# EAGLE design MY9942_CON_4 (EAGLE 9.6.2)
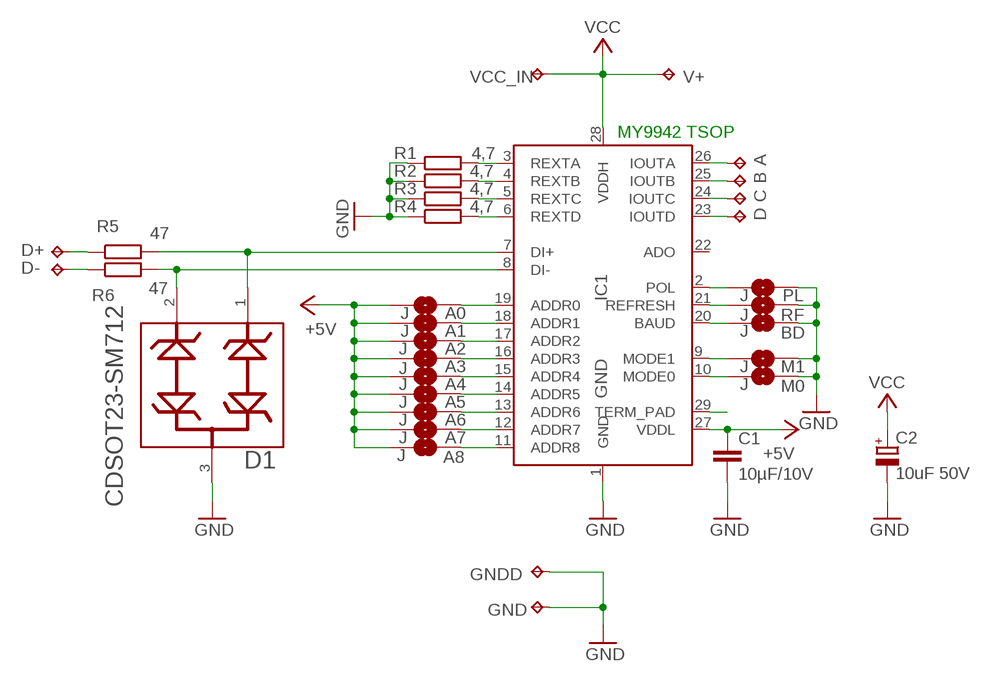
[diagram p0: schematic, sheet 1]

## Parts
A  TPPAD1-13  [P1-13]
A0  J  JUMPER-SMT_2_NO_SILK  [SMT-JUMPER_2_NO_SILK]
A1  J  JUMPER-SMT_2_NO_SILK  [SMT-JUMPER_2_NO_SILK]
A2  J  JUMPER-SMT_2_NO_SILK  [SMT-JUMPER_2_NO_SILK]
A3  J  JUMPER-SMT_2_NO_SILK  [SMT-JUMPER_2_NO_SILK]
A4  J  JUMPER-SMT_2_NO_SILK  [SMT-JUMPER_2_NO_SILK]
A5  J  JUMPER-SMT_2_NO_SILK  [SMT-JUMPER_2_NO_SILK]
A6  J  JUMPER-SMT_2_NO_SILK  [SMT-JUMPER_2_NO_SILK]
A7  J  JUMPER-SMT_2_NO_SILK  [SMT-JUMPER_2_NO_SILK]
A8  J  JUMPER-SMT_2_NO_SILK  [SMT-JUMPER_2_NO_SILK]
B  TPPAD1-13  [P1-13]
BD  J  JUMPER-SMT_2_NO_SILK  [SMT-JUMPER_2_NO_SILK]
C  TPPAD1-13  [P1-13]
C1  10µF/10V  C-EUC0805  [C0805]
C2  10uF 50V  CPOL-EUSMCC  [SMC_C]
D  TPPAD1-13  [P1-13]
D1  SM712 / SOT23-3  BOURNS_INC._CDSOT23-SM712BOURNS_INC._CDSOT23-SM712_0_0  [BOURNS_INC._CDSOT23-SM712_0]
D+  TPPAD1-13  [P1-13]
D-  TPPAD1-13  [P1-13]
GND  TPPAD1-13  [P1-13]
GNDD  TPPAD1-13  [P1-13]
IC1  GND  MY9942TETSSOP28  [TSSOP28]
M0  J  JUMPER-SMT_2_NO_SILK  [SMT-JUMPER_2_NO_SILK]
M1  J  JUMPER-SMT_2_NO_SILK  [SMT-JUMPER_2_NO_SILK]
PL  J  JUMPER-SMT_2_NO_SILK  [SMT-JUMPER_2_NO_SILK]
R1  4,7  R-EU_R0805  [R0805]
R2  4,7  R-EU_R0805  [R0805]
R3  4,7  R-EU_R0805  [R0805]
R4  4,7  R-EU_R0805  [R0805]
R5  47  R-EU_R0805  [R0805]
R6  47  R-EU_R0805  [R0805]
RF  J  JUMPER-SMT_2_NO_SILK  [SMT-JUMPER_2_NO_SILK]
V+  TPPAD1-13  [P1-13]
VCC_IN  TPPAD1-13  [P1-13]

## Nets
+5V: A0.1 A1.1 A2.1 A3.1 A4.1 A5.1 A6.1 A7.1 A8.1 C1.1 IC1.27(VDDL)
A: A.TP IC1.26(IOUTA)
B: B.TP IC1.25(IOUTB)
C: C.TP IC1.24(IOUTC)
D: D.TP IC1.23(IOUTD)
D+: D1.1 IC1.7(DI+) R5.2
D-: D1.2 IC1.8(DI-) R6.2
GND: BD.2 C1.2 C2.- D1.3 GND.TP GNDD.TP IC1.1(GND) M0.2 M1.2 PL.2 R1.1 R2.1 R3.1 R4.1 RF.2
N$1: A8.2 IC1.11(ADDR8)
N$2: A7.2 IC1.12(ADDR7)
N$3: A6.2 IC1.13(ADDR6)
N$4: A5.2 IC1.14(ADDR5)
N$5: A4.2 IC1.15(ADDR4)
N$6: A3.2 IC1.16(ADDR3)
N$7: A2.2 IC1.17(ADDR2)
N$8: A1.2 IC1.18(ADDR1)
N$9: A0.2 IC1.19(ADDR0)
N$10: D+.TP R5.1
N$11: IC1.3(REXTA) R1.2
N$12: IC1.4(REXTB) R2.2
N$13: IC1.5(REXTC) R3.2
N$14: IC1.6(REXTD) R4.2
N$15: D-.TP R6.1
N$16: BD.1 IC1.20(BAUD)
N$17: IC1.9(MODE1) M1.1
N$18: IC1.10(MODE0) M0.1
N$31: IC1.21(REFRESH) RF.1
N$32: IC1.2(POL) PL.1
TERM: IC1.29(TERM_PAD)
VCC: C2.+ IC1.28(VDDH) V+.TP VCC_IN.TP
Unconnected: IC1.22(ADO)

## Notes on the sheet
- MY9942 TSOP

## Library data of the parts
A B C D D+ D- GND GNDD V+ VCC_IN = testpad:TP: Test pad
A0 A1-A8 BD M0 M1 PL RF = SparkFun-Jumpers:JUMPER-SMT_2_NO: Normally open jumper This jumper has two pads in close proximity to each other. Apply solder to close the connection. Round pads are easier to solder for beginners, but are a lot larger. SparkFun Product that uses the round pads: SparkFun EL Sequencer <https://www.sparkfun.com/products/12781>
C1 = rcl:C-EU: CAPACITOR, European symbol; SPICEPREFIX: C
C2 = rcl:CPOL-EU: POLARIZED CAPACITOR, European symbol; SPICEPREFIX: C
D1 = Bourns Inc. - CDSOT23-SM712:BOURNS_INC._CDSOT23-SM712: 26V, 14V Clamp 17A (8/20µs) Ipp Tvs Diode Surface Mount SOT-23-3; AUTOMOTIVE: No; BREAKDOWN_VOLTAGE: 7.5V; CAPACITANCE: 75pF; CENTROID_NOT_SPECIFIED: No; CLAMPING_VOLTAGE: 26V; DATASHEET: https://www.bourns.com/docs/Product-Datasheets/CDSOT23-SM712.pdf; DEVICE_CLASS_L1: Circuit Protection; DEVICE_CLASS_L2: TVS Diodes; DEVICE_CLASS_L3: unset; DIGIKEY_DESCRIPTION: DIODE TVS DIODE 7V/12V 14V/26V SOT23-3; DIGIKEY_PART_NUMBER: CDSOT23-SM712CT-ND; DIRECTION: Bidirectional; FOOTPRINT_PARAMETERS_1: {"fp_type":"SOT23","params":{"N":{"default":"3","long name":"Number of leads","type":"multichoice","short name":"N"},"A":{"nom":false,"long name":"Height","min":890000,"max":1170000,"short name":"A","type":"measurement"},"A1":{"nom":false,"long name":"Package clearance","min":50000,"max":150000,"short name":"A1","type":"measurement"},"A2":{"nom":false,"long name":"Package height","min":false,"max":1120000,"short name":"A2","type":"measurement"},"D":{"nom":false,"long name":"Package length","min":2800000,"max":3000000,"short name":"D","type":"measurement"},"E":{"nom":false,"long name":"Width /w leads","min":2100000,"max":2490000,"short name":"E","type":"measurement"},"E1":{"nom":false,"long name":"Package width","min":1200000,"max":1400000,"short name":"E1","type":"measurement"},"B":{"nom":false,"long name":"Lead width","min":300000,"max":500000,"short name":"B","type":"measurement"},"C":{"nom":false,"long name":"Lead thickness","min":80000,"max":200000,"short name":"C","type":"measurement"},"L":{"nom":false,"long name":"Lead foot length","min":400000,"max":580000,"short name":"L","type":"measurement"},"e":{"nom":950000,"long name":"Lead pitch","min":null,"max":null,"short name":"e","type":"measurement"},"PHI":{"nom":false,"long name":"Lead angle","min":0,"max":8,"short name":"PHI","type":"measurement"},"offset x":{"nom":0,"long name":"X Center offset","min":null,"max":null,"short name":"offset x","type":"measurement"},"offset y":{"nom":0,"long name":"Y Center offset","min":null,"max":null,"short name":"offset y","type":"measurement"},"LS":{"default":"Rounded rectangle","long name":"Land shape","type":"multichoice","short name":"LS"},"LS1":{"default":"Rectangle","long name":"Land shape (Pin 1)","type":"multichoice","short name":"LS1"},"solder toe":{"nom":550000,"long name":"Solder fillet (toe)","min":null,"max":null,"short name":"solder toe","type":"fixedmeasurement"},"solder heel":{"nom":450000,"long name":"Solder fillet (heel)","min":null,"max":null,"short name":"solder heel","type":"fixedmeasurement"},"solder side":{"nom":50000,"long name":"Solder fillet (side)","min":null,"max":null,"short name":"solder side","type":"fixedmeasurement"},"courtyard":{"nom":500000,"long name":"Courtyard","min":null,"max":null,"short name":"courtyard","type":"fixedmeasurement"},"SF":{"default":"A","long name":"Packing level","type":"multichoiceparent","short name":"SF","help":"http://support.upverter.com/customer/portal/articles/978783-what-is-a-footprint-packing-level","children":["solder toe","solder heel","solder side","courtyard"]}}}; FOOTPRINT_PARAMETERS_2: {"fp_type":"SOT23","params":{"N":{"default":"3","long name":"Number of leads","type":"multichoice","short name":"N"},"A":{"nom":false,"long name":"Height","min":890000,"max":1170000,"short name":"A","type":"measurement"},"A1":{"nom":false,"long name":"Package clearance","min":50000,"max":150000,"short name":"A1","type":"measurement"},"A2":{"nom":false,"long name":"Package height","min":false,"max":1120000,"short name":"A2","type":"measurement"},"D":{"nom":false,"long name":"Package length","min":2800000,"max":3000000,"short name":"D","type":"measurement"},"E":{"nom":false,"long name":"Width /w leads","min":2100000,"max":2490000,"short name":"E","type":"measurement"},"E1":{"nom":false,"long name":"Package width","min":1200000,"max":1400000,"short name":"E1","type":"measurement"},"B":{"nom":false,"long name":"Lead width","min":300000,"max":500000,"short name":"B","type":"measurement"},"C":{"nom":false,"long name":"Lead thickness","min":80000,"max":200000,"short name":"C","type":"measurement"},"L":{"nom":false,"long name":"Lead foot length","min":400000,"max":580000,"short name":"L","type":"measurement"},"e":{"nom":950000,"long name":"Lead pitch","min":null,"max":null,"short name":"e","type":"measurement"},"PHI":{"nom":false,"long name":"Lead angle","min":0,"max":8,"short name":"PHI","type":"measurement"},"offset x":{"nom":0,"long name":"X Center offset","min":null,"max":null,"short name":"offset x","type":"measurement"},"offset y":{"nom":0,"long name":"Y Center offset","min":null,"max":null,"short name":"offset y","type":"measurement"},"LS":{"default":"Rounded rectangle","long name":"Land shape","type":"multichoice","short name":"LS"},"LS1":{"default":"Rectangle","long name":"Land shape (Pin 1)","type":"multichoice","short name":"LS1"},"solder toe":{"nom":350000,"long name":"Solder fillet (toe)","min":null,"max":null,"short name":"solder toe","type":"fixedmeasurement"},"solder heel":{"nom":350000,"long name":"Solder fillet (heel)","min":null,"max":null,"short name":"solder heel","type":"fixedmeasurement"},"solder side":{"nom":30000,"long name":"Solder fillet (side)","min":null,"max":null,"short name":"solder side","type":"fixedmeasurement"},"courtyard":{"nom":250000,"long name":"Courtyard","min":null,"max":null,"short name":"courtyard","type":"fixedmeasurement"},"SF":{"default":"B","long name":"Packing level","type":"multichoiceparent","short name":"SF","help":"http://support.upverter.com/customer/portal/articles/978783-what-is-a-footprint-packing-level","children":["solder toe","solder heel","solder side","courtyard"]}}}; FOOTPRINT_PARAMETERS_3: {"fp_type":"SOT23","params":{"N":{"default":"3","long name":"Number of leads","type":"multichoice","short name":"N"},"A":{"nom":false,"long name":"Height","min":890000,"max":1170000,"short name":"A","type":"measurement"},"A1":{"nom":false,"long name":"Package clearance","min":50000,"max":150000,"short name":"A1","type":"measurement"},"A2":{"nom":false,"long name":"Package height","min":false,"max":1120000,"short name":"A2","type":"measurement"},"D":{"nom":false,"long name":"Package length","min":2800000,"max":3000000,"short name":"D","type":"measurement"},"E":{"nom":false,"long name":"Width /w leads","min":2100000,"max":2490000,"short name":"E","type":"measurement"},"E1":{"nom":false,"long name":"Package width","min":1200000,"max":1400000,"short name":"E1","type":"measurement"},"B":{"nom":false,"long name":"Lead width","min":300000,"max":500000,"short name":"B","type":"measurement"},"C":{"nom":false,"long name":"Lead thickness","min":80000,"max":200000,"short name":"C","type":"measurement"},"L":{"nom":false,"long name":"Lead foot length","min":400000,"max":580000,"short name":"L","type":"measurement"},"e":{"nom":950000,"long name":"Lead pitch","min":null,"max":null,"short name":"e","type":"measurement"},"PHI":{"nom":false,"long name":"Lead angle","min":0,"max":8,"short name":"PHI","type":"measurement"},"offset x":{"nom":0,"long name":"X Center offset","min":null,"max":null,"short name":"offset x","type":"measurement"},"offset y":{"nom":0,"long name":"Y Center offset","min":null,"max":null,"short name":"offset y","type":"measurement"},"LS":{"default":"Rounded rectangle","long name":"Land shape","type":"multichoice","short name":"LS"},"LS1":{"default":"Rectangle","long name":"Land shape (Pin 1)","type":"multichoice","short name":"LS1"},"solder toe":{"nom":150000,"long name":"Solder fillet (toe)","min":null,"max":null,"short name":"solder toe","type":"fixedmeasurement"},"solder heel":{"nom":250000,"long name":"Solder fillet (heel)","min":null,"max":null,"short name":"solder heel","type":"fixedmeasurement"},"solder side":{"nom":10000,"long name":"Solder fillet (side)","min":null,"max":null,"short name":"solder side","type":"fixedmeasurement"},"courtyard":{"nom":100000,"long name":"Courtyard","min":null,"max":null,"short name":"courtyard","type":"fixedmeasurement"},"SF":{"default":"C","long name":"Packing level","type":"multichoiceparent","short name":"SF","help":"http://support.upverter.com/customer/portal/articles/978783-what-is-a-footprint-packing-level","children":["solder toe","solder heel","solder side","courtyard"]}}}; FOOTPRINT_VARIANT_NAME_0: Recommended_Land_Pattern; FOOTPRINT_VARIANT_NAME_1: IPC_A; FOOTPRINT_VARIANT_NAME_2: IPC_B; FOOTPRINT_VARIANT_NAME_3: IPC_C; HEIGHT: 1.17mm; IPC_LAND_PATTERN_NAME: SOT95P229X103-3; LEAD_FREE: Yes; MF: Bourns Inc.; MFG_PACKAGE_IDENT: SOT23; MFG_PACKAGE_IDENT_DATE: 0; MFG_PACKAGE_IDENT_REV: 0; MOUSER_DESCRIPTION: Transient Voltage Suppressor, TVS, CDSOT23 Series, Unidirectional, 12 V, SOT-23, 3, 13.3 V; MOUSER_PART_NUMBER: 652-CDSOT23-SM712; MPN: CDSOT23-SM712; NUMBER_OF_CHANNELS: 2; PACKAGE: SOT23-3; PEAK_PULSE_CURRENT: 17A; PEAK_PULSE_POWER: 400W; PREFIX: D; REVERSE_STANDOFF_VOLTAGE: 12V; ROHS: Yes; STANDOFF_HEIGHT: 0.05mm; TEMPERATURE_RANGE_HIGH: +150°C; TEMPERATURE_RANGE_LOW: -55°C; VERIFICATION_VERSION: 0.0.0.3
IC1 = MY9942:MY9942TE
R1-R4 = resistor:R-EU_: RESISTOR, European symbol
R5 R6 = rcl:R-EU_: RESISTOR, European symbol; SPICEPREFIX: R

## Board
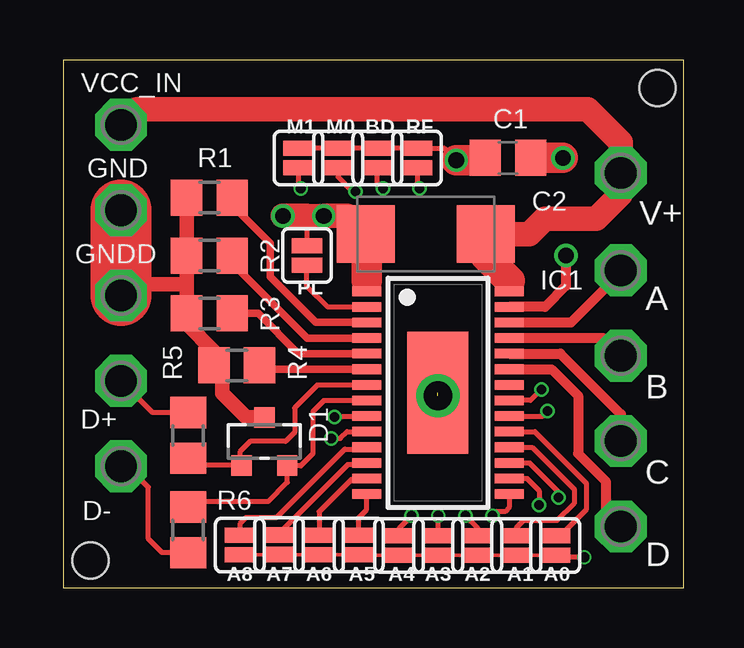
[diagram p1: board, top side]
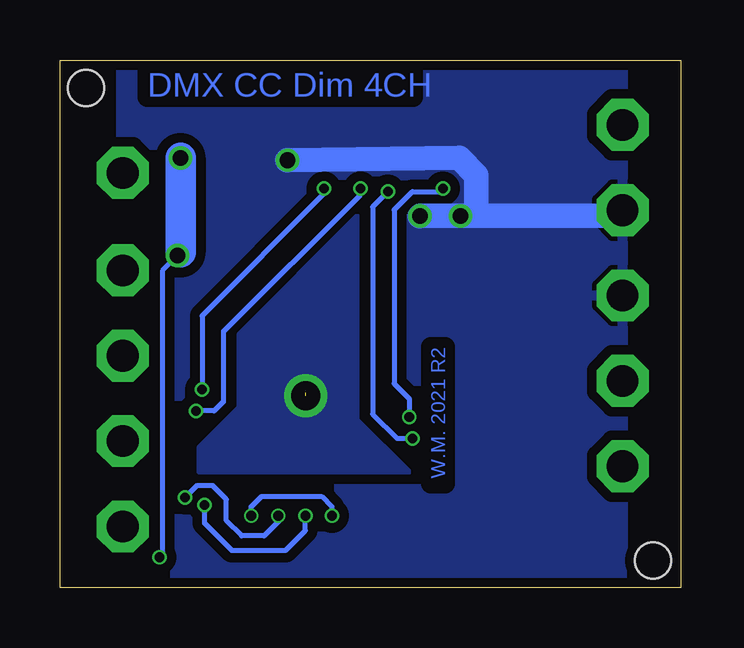
[diagram p2: board, bottom side, seen from below]

Size 25.86 x 21.99 mm. Coordinates in mm from the lower left corner, seen from the top.
Outline: 0,0 25.86,0 25.86,21.99 0,21.99 0,0
Copper layers (1*16): Top 0.018mm / dielectric 1.55mm / Bottom 0.018mm
Design rules "Multi-CB_2L_100µm-Tracks_OL35µm": minimum track width 0.1mm, minimum drill 0.2mm, track to track 0.1mm, track to pad 0.1mm, pad to pad 0.1mm, via to via 0.1mm, smd to smd 0mil, copper to edge 0.2mm, drill to drill 0.2mm, minimum pad ring 0.125mm, minimum via ring 0.1mm, stop-mask expansion 2mil, vias tented up to drill 0.45mm, thermal gap 0.2mm
Holes 1.5 mm at 24.77,20.83 1.14,1.14

### Footprints (pad centres in the part's own frame; a part is rotated, then mirrored left to right if it is on the bottom)
P1-13 = drill 1.321 pad 2.159 octagon: TP 0,0
SMT-JUMPER_2_NO_SILK = smd 0.635 x 1.27: 1 -0.406,0; 2 0.406,0
C0805 = smd 1.3 x 1.5: 1 -0.95,0; 2 0.95,0
SMC_C = smd 2.4 x 2.4: + -2.5,0; - 2.5,0
BOURNS_INC._CDSOT23-SM712_0 = smd 0.85 x 0.85: 1 -1,0.95; 2 -1,-0.95; 3 1,0
TSSOP28 = smd 0.4 x 1.2: 1 -4.225,-2.97; 2 -3.575,-2.97; 3 -2.925,-2.97; 4 -2.275,-2.97; 5 -1.625,-2.97; 6 -0.975,-2.97; 7 -0.325,-2.97; 8 0.325,-2.97; 9 0.975,-2.97; 10 1.625,-2.97; 11 2.275,-2.97; 12 2.925,-2.97; 13 3.575,-2.97; 14 4.225,-2.97; 15 4.225,2.97; 16 3.575,2.97; 17 2.925,2.97; 18 2.275,2.97; 19 1.625,2.97; 20 0.975,2.97; 21 0.325,2.97; 22 -0.325,2.97; 23 -0.975,2.97; 24 -1.625,2.97; 25 -2.275,2.97; 26 -2.925,2.97; 27 -3.575,2.97; 28 -4.225,2.97 | smd 5.08 x 2.54: 29 0,0
R0805 = smd 1.3 x 1.5: 1 -0.95,0; 2 0.95,0

### Placement (x,y rotation side)
A  23.24,13.22 0 top
A0  20.51,1.76 90 top
A1  18.89,1.76 90 top
A2  17.25,1.76 90 top
A3  15.63,1.76 90 top
A4  14,1.76 90 top
A5  12.32,1.78 90 top
A6  10.67,1.78 90 top
A7  9,1.79 90 top
A8  7.37,1.78 90 top
B  23.24,9.67 0 top
BD  13.1,17.91 90 top
C  23.24,6.11 0 top
C1  18.54,17.91 180 top
C2  15.11,14.73 180 top
D  23.24,2.56 0 top
D1  8.39,6.1 90 top
D+  2.41,8.62 0 top
D-  2.41,5.06 0 top
GND  2.41,15.73 0 top
GNDD  2.41,12.18 0 top
IC1  15.62,8.13 270 top
M0  11.46,17.91 90 top
M1  9.81,17.91 90 top
PL  10.16,13.84 90 top
R1  6.1,16.26 0 top
R2  6.1,13.84 0 top
R3  6.1,11.43 0 top
R4  7.24,9.27 0 top
R5  5.21,6.35 270 top
R6  5.21,2.41 90 top
RF  14.75,17.91 90 top
V+  23.24,17.29 0 top
VCC_IN  2.41,19.29 0 top

### Tracks (layer width: path | path; a pad name or v marks a point on that pad's centre or on a via)
+5V  (via drill 0.4, 0.65)
  Top 0.15: A1.1 A2.1 A3.1 A4.1 12.34,1.36 A5.1 A6.1 9.02,1.37 A7.1 8.99,1.37 A8.1
  Top 0.152: 19.23,11.68 IC1.27 | A1.1 A0.1 20.59,1.27
  Top 0.203: v21.72,1.27 20.59,1.27
  Top 0.406: v20.95,13.84 20.95,12.57 20.08,11.7 IC1.27
  Top 1.27: v20.83,17.91 C1.1
  Bottom 0.203: v20.95,13.84 21.59,13.21 21.59,1.4 v21.72,1.27
  Bottom 0.406: v20.95,13.84 20.83,13.97
  Bottom 1.27: v20.83,17.91 20.83,13.97
A
  Top 0.406: A.TP 23.24,13.13 21.17,11.05 IC1.26
B
  Top 0.406: B.TP 22.51,10.4 IC1.25
C
  Top 0.406: IC1.24 20.73,9.75 23.24,7.24 C.TP
D
  Top 0.406: IC1.23 20.36,9.1 21.46,8 21.46,5.59 22.61,4.45 22.61,3.19 D.TP
D+
  Top 0.203: R5.2 5.51,5.1 D1.1 7.37,5.17 7.37,5.66 7.8,6.1 9.27,6.1 9.65,6.48 9.65,7.49 10.61,8.45 IC1.7
D-
  Top 0.203: R6.2 5.44,3.59 8.54,3.59 9.34,4.39 D1.2 9.36,5.08 9.91,5.08 10.41,5.59 10.41,7.34 10.88,7.8 IC1.8
GND  (via drill 0.65)
  Top 0.15: R4.1 6.29,8.77
  Top 0.152: C2.- 12.57,14.73 | 5.15,11 R3.1 | 6.64,8.92 R4.1
  Top 0.203: M1.2 M0.2 BD.2 RF.2 15.88,18.31 v16.38,17.81 | 10.16,15.5 PL.2
  Top 0.406: 12.65,12.8 IC1.1
  Top 0.61: 2.41,11.68 GNDD.TP 2.88,12.64 5.15,12.64 | 5.15,11 6.29,9.86 R4.1 | R1.1 R2.1 5.15,12.64 | 2.41,13.72 2.54,13.84 | D1.3 7.63,7.1 6.64,8.1 6.64,8.92 | R3.1 5.15,12.64
  Top 1.016: C2.- 11.85,15.49 10.87,15.49 v10.86,15.48 10.17,15.48 10.16,15.5 v9.16,15.5
  Top 1.27: 12.65,12.8 12.65,14.69 C2.- | v16.38,17.81 17.5,17.81 C1.2
  Top 2.54: GND.TP 2.41,13.72 GNDD.TP
  Bottom 1.016: v16.38,17.81 9.22,17.91 8.51,17.19 8.51,15.5 | 8.51,15.5 v9.16,15.5 10.85,15.5 v10.86,15.48 | 8.51,15.5 2.65,15.5 GND.TP
  pour Bottom (isolate 0.406, rank 2): 2.38,22 23.32,22 23.32,0 2.38,0
N$1
  Top 0.203: A8.2 7.37,2.67 7.62,2.92 8.89,2.92 11.75,5.78 12.58,5.78 IC1.11
N$2
  Top 0.203: A7.2 9,2.27 11.87,5.14 12.59,5.14 IC1.12
N$3
  Top 0.203: A6.2 10.67,3.17 12,4.51 12.61,4.51 IC1.13
N$4
  Top 0.203: A5.2 12.32,2.92 12.65,3.25 IC1.14
N$5  (via drill 0.4)
  Top 0.152: 14,2.19 A4.2
  Top 0.203: v14.52,3 14,2.48 A4.2 | v17.89,3 18.06,3.17 18.41,3.17 18.59,3.35 IC1.15
  Bottom 0.203: v17.89,3 17.89,3.38 17.46,3.81 14.95,3.81 14.52,3.38 v14.52,3
N$6  (via drill 0.4)
  Top 0.203: A3.2 v15.63,3 | IC1.16 19.32,4.55 19.83,4.04 v19.83,3.45
  Bottom 0.203: v15.63,3 15.63,2.38 16.46,1.56 18.7,1.56 19.83,2.69 v19.83,3.45
N$7  (via drill 0.4)
  Top 0.203: v16.76,3 17.27,2.49 17.27,2.18 A2.2 | IC1.17 19.43,5.2 20.64,4 v20.64,3.76
  Bottom 0.203: v16.76,3 16.76,2.75 17.35,2.16 18.29,2.16 18.92,2.79 18.92,3.68 19.51,4.27 20.13,4.27 v20.64,3.76
N$8
  Top 0.203: A1.2 18.89,2.51 19.18,2.79 20.57,2.79 21.29,3.51 21.29,4.11 19.55,5.85 IC1.18
N$9
  Top 0.203: A0.2 20.71,2.17 21.8,3.26 21.8,4.36 19.66,6.5 IC1.19
N$10
  Top 0.203: R5.1 3.73,7.3 D+.TP
N$11
  Top 0.305: IC1.3 10.54,11.05 8.64,12.95 8.64,14.35 7.05,15.94 R1.2
N$12
  Top 0.305: IC1.4 10.17,10.4 7.05,13.53 R2.2
N$13
  Top 0.305: IC1.5 9.8,9.75 8.13,11.43 R3.2
N$14
  Top 0.152: R4.2 8.36,9.1
  Top 0.305: IC1.6 8.36,9.1
N$15
  Top 0.203: R6.1 4.12,1.46 3.56,2.03 3.56,4.19 2.68,5.06 D-.TP
N$16  (via drill 0.4)
  Top 0.203: IC1.20 19.98,7.15 v20.19,7.37 | v13.34,16.64 13.1,16.88 BD.1
  Bottom 0.203: v20.19,7.37 19.43,7.37 19.05,7.75 19.05,10.67 13.34,16.38 v13.34,16.64
N$17  (via drill 0.4)
  Top 0.203: v9.91,16.64 9.81,16.73 M1.1 | v11.3,7.11 11.34,7.15 IC1.9
  Bottom 0.203: v9.91,16.64 10.03,16.51 11.18,16.51 11.94,15.75 11.94,8.51 11.3,7.87 v11.3,7.11
N$18  (via drill 0.4)
  Top 0.203: M0.1 11.46,17.12 12.07,16.51 v12.19,16.51 | IC1.10 11.84,6.5 11.56,6.22 v11.18,6.22
  Bottom 0.203: v12.19,16.51 12.83,15.88 12.83,7.24 11.81,6.22 v11.18,6.22
N$31  (via drill 0.4)
  Top 0.152: 14.86,16.75 14.75,16.87
  Top 0.203: IC1.21 19.49,7.8 v19.94,8.26 | RF.1 14.75,16.87 | 14.86,16.75 v14.86,16.64
  Bottom 0.203: v19.94,8.26 19.94,11.33 14.86,16.41 v14.86,16.64
N$32
  Top 0.203: PL.1 10.16,12.57 11.03,11.7 IC1.2
TERM  (via drill 1.2)  (1 unrouted)
  other vias: 15.62,8
  pour Bottom: 13.46,15.49 18.41,10.54 18.41,7.49 20.07,5.84 20.07,4.83 11.3,4.83 13.46,6.99
VCC
  Top 0.406: IC1.28 18.62,12.38 18.62,12.8
  Top 1.016: C2.+ 19.43,14.73 20.07,15.37 22.21,15.37 23.24,16.4 V+.TP 23.24,18.56 21.86,19.94 3.06,19.94 VCC_IN.TP
  Top 1.27: C2.+ 17.61,13.8 18.62,12.8

### Text on the board
Bottom: DMX CC Dim 4CH | W.M. 2021 R2